# Altium schematic sheet 12V_Power.SchDoc
size A4; SheetNumber: 5; SheetTotal: 5
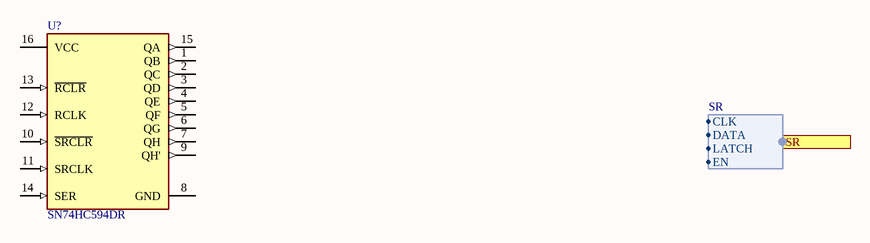
[diagram p0: 12V_Power.SchDoc]

## Parts
U?  SN74HC594DR  [FP-D0016A-IPC_A]

## Ports
SR (harness SR)

## Harnesses
SR: CLK, DATA, LATCH, EN

## Nets

Not connected (* = marked no-connect by the designer): U? 1(QB) 2(QC) 3(QD) 4(QE) 5(QF) 6(QG) 7(QH) 8(GND) 9(QH') 10(~{SRCLR}) 11(SRCLK) 12(RCLK) 13(~{RCLR}) 14(SER) 15(QA) 16(VCC)

## Library data of the parts
U? = CMP-0780-00061-4: IC SHIFT REGISTER 8BIT 16-SOIC; Number of Bits per Element: 8; Min Supply Voltage: 2V; Frequency: 40MHz; Max Supply Voltage: 6V; Operating Supply Voltage: 5V; Number of Output Lines: 10; Propagation Delay: 25ns; Number of Elements: 1; Number of Circuits: 4; Direction: Unidirectional; Turn-On Delay Time: 185ns; RoHS Compliant: Yes; Width: 3.91mm; Length: 9.9mm; Min Operating Temperature: -40°C; Max Operating Temperature: 125°C; Package Quantity: 2500; Series: 74HC; Height: 1.58mm; Number of Bits: 8; Mount: Surface Mount; Logic Function: Shift Register; Radiation Hardening: No; Number of Pins: 16; Technology: CMOS; Packaging: Tape and Reel; Lead Free: Lead Free; Weight: 0.004998oz; REACH SVHC: No SVHC; Case/Package: SOIC